# EAGLE design controller (EAGLE 9.2.0)
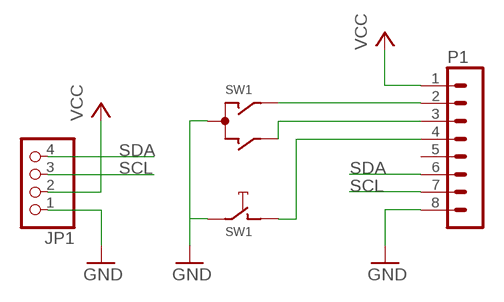
[diagram p0: schematic, sheet 1]

## Parts
JP1  PINHD-1X4  [1X04]
P1  B8B-PH-K  [B8B-PH-K]
SW1  OG-ENCODER_EC12E_SW  [OG-ENCODER_ALPS_EC12E_SW]

## Nets
GND: JP1.1 P1.8 SW1.C SW1.E
N$1: P1.2 SW1.A
N$2: P1.3 SW1.B
N$3: P1.4 SW1.D
SCL: JP1.3 P1.7
SDA: JP1.4 P1.6
VCC: JP1.2 P1.1
Unconnected: P1.5 SW1.GND1(G) SW1.GND2(G)

## Library data of the parts
JP1 = pinhead:PINHD-1X4: PIN HEADER
P1 = con-jst-ph:B8B-PH-K: HEADER
SW1 = from-mi:OG-ENCODER_EC12E_SW: ALPS rotary Encoder EC12E series with switch

## Net classes
0 default: width 0.254 mm, clearance 0.254 mm
1 VCC: width 0.508 mm, clearance 0.508 mm
2 GND: width 0.254 mm, clearance 0.508 mm

## Board
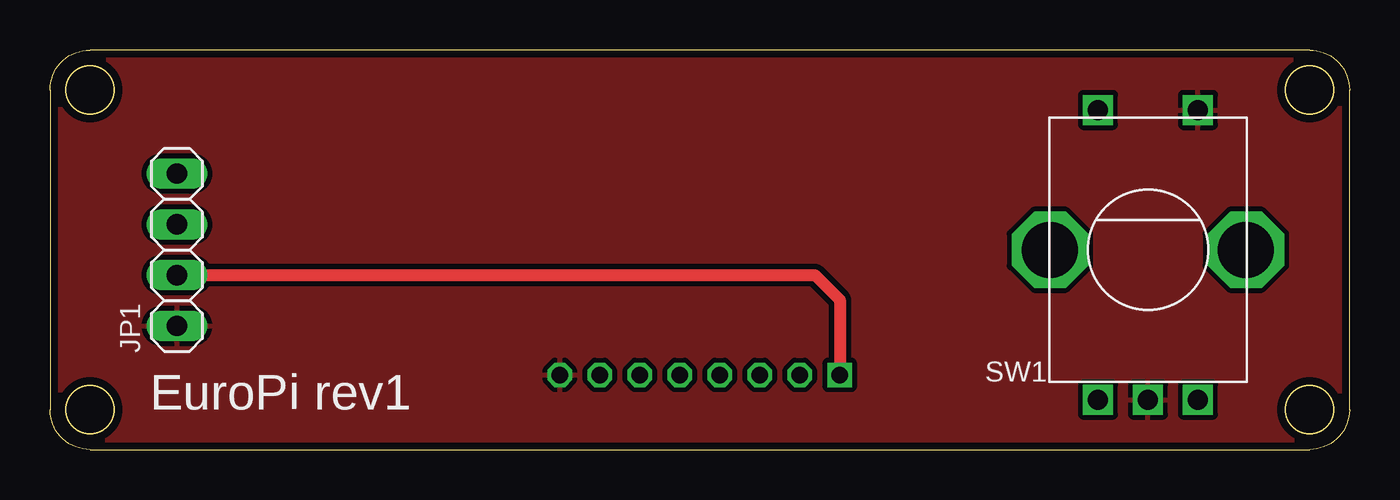
[diagram p1: board, top side]
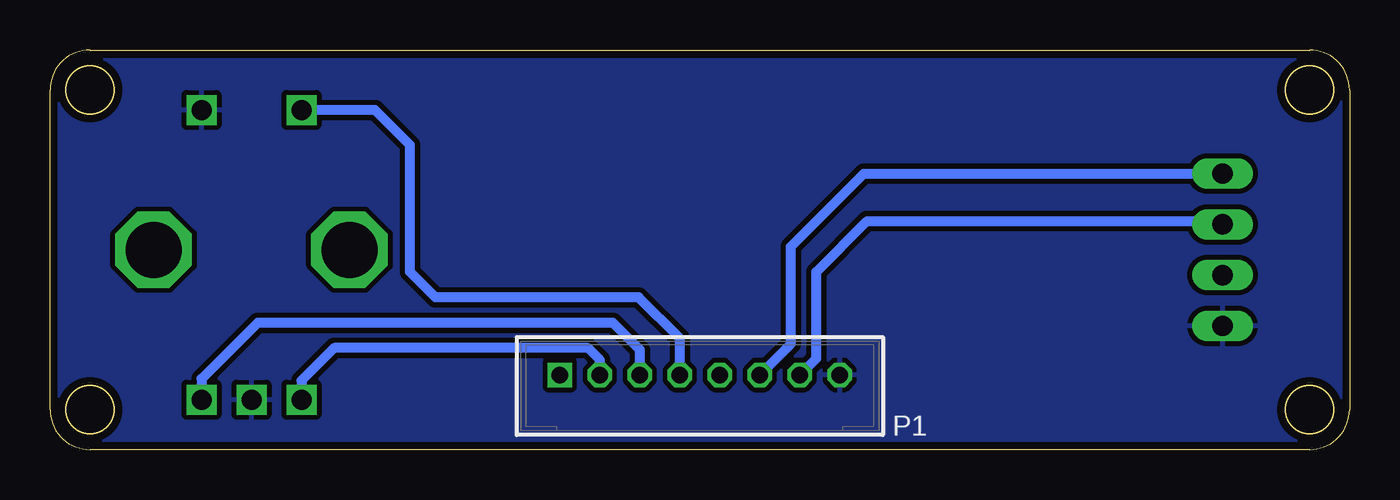
[diagram p2: board, bottom side, seen from below]

Size 65 x 20 mm. Coordinates in mm from the lower left corner, seen from the top.
Outline: 2,0 63,0 arc90 65,2 65,18 arc90 63,20 2,20 arc90 0,18 0,2 arc90 2,0
Outline: circle at 2,2 radius 1.2
Outline: circle at 2,18 radius 1.2
Outline: circle at 63,18 radius 1.2
Outline: circle at 63,2 radius 1.2
Copper layers (1*16): Top 0.035559375mm / dielectric 1.6mm / Bottom 0.035559375mm
Design rules "oshpark-2layer": minimum track width 6mil, minimum drill 10mil, track to track 6mil, track to pad 6mil, pad to pad 6mil, via to via 6mil, smd to smd 6mil, copper to edge 15mil, drill to drill 6mil, minimum pad ring 5mil, minimum via ring 5mil, stop-mask expansion 2.5mil, vias tented up to drill 0mil, thermal gap 10mil

### Footprints (pad centres in the part's own frame; a part is rotated, then mirrored left to right if it is on the bottom)
1X04 = drill 1.016 long: 1 -3.81,0; 2 -1.27,0; 3 1.27,0; 4 3.81,0
B8B-PH-K = drill 0.813 square: 1 -7,0 | drill 0.813 octagon: 2 -5,0; 3 -3,0; 4 -1,0; 5 1,0; 6 3,0; 7 5,0; 8 7,0
OG-ENCODER_ALPS_EC12E_SW = drill 1 square: A -2.5,-7.5; B 2.5,-7.5; C 0,-7.5; D -2.5,7; E 2.5,7 | drill 2.8 octagon: GND1 -4.9,0; GND2 4.9,0

### Placement (x,y rotation side)
JP1  6.35,10 90 top
P1  32.5,3.73 0 bottom
SW1  54.92,10 0 top

### Tracks (layer width: path | path; a pad name or v marks a point on that pad's centre or on a via)
GND
  pour Top: 0,20 0,0 65,0 65,20
  pour Bottom: 0,20 65,20 65,0 0,0
N$1
  Bottom 0.508: P1.2 37.5,4.48 38.1,5.08 50.8,5.08 52.42,3.46 SW1.A
N$2
  Bottom 0.508: P1.3 35.5,5 36.85,6.35 54.61,6.35 57.42,3.54 SW1.B
N$3
  Bottom 0.508: P1.4 33.5,5.56 35.56,7.62 45.72,7.62 46.99,8.89 46.99,15.24 48.75,17 SW1.D
SCL
  Bottom 0.254: 6.51,11.43 JP1.3
  Bottom 0.508: P1.7 26.67,4.56 26.67,8.89 24.13,11.43 6.51,11.43
SDA
  Bottom 0.508: P1.6 27.94,5.29 27.94,10.16 24.29,13.81 JP1.4
VCC
  Top 0.61: JP1.2 38.26,8.73 39.5,7.49 P1.1

### Text on the board
tNames: EuroPi rev1